# Altium schematic sheet Giro_scope_2.0.SchDoc
size A1; SheetNumber: 1; SheetTotal: 1
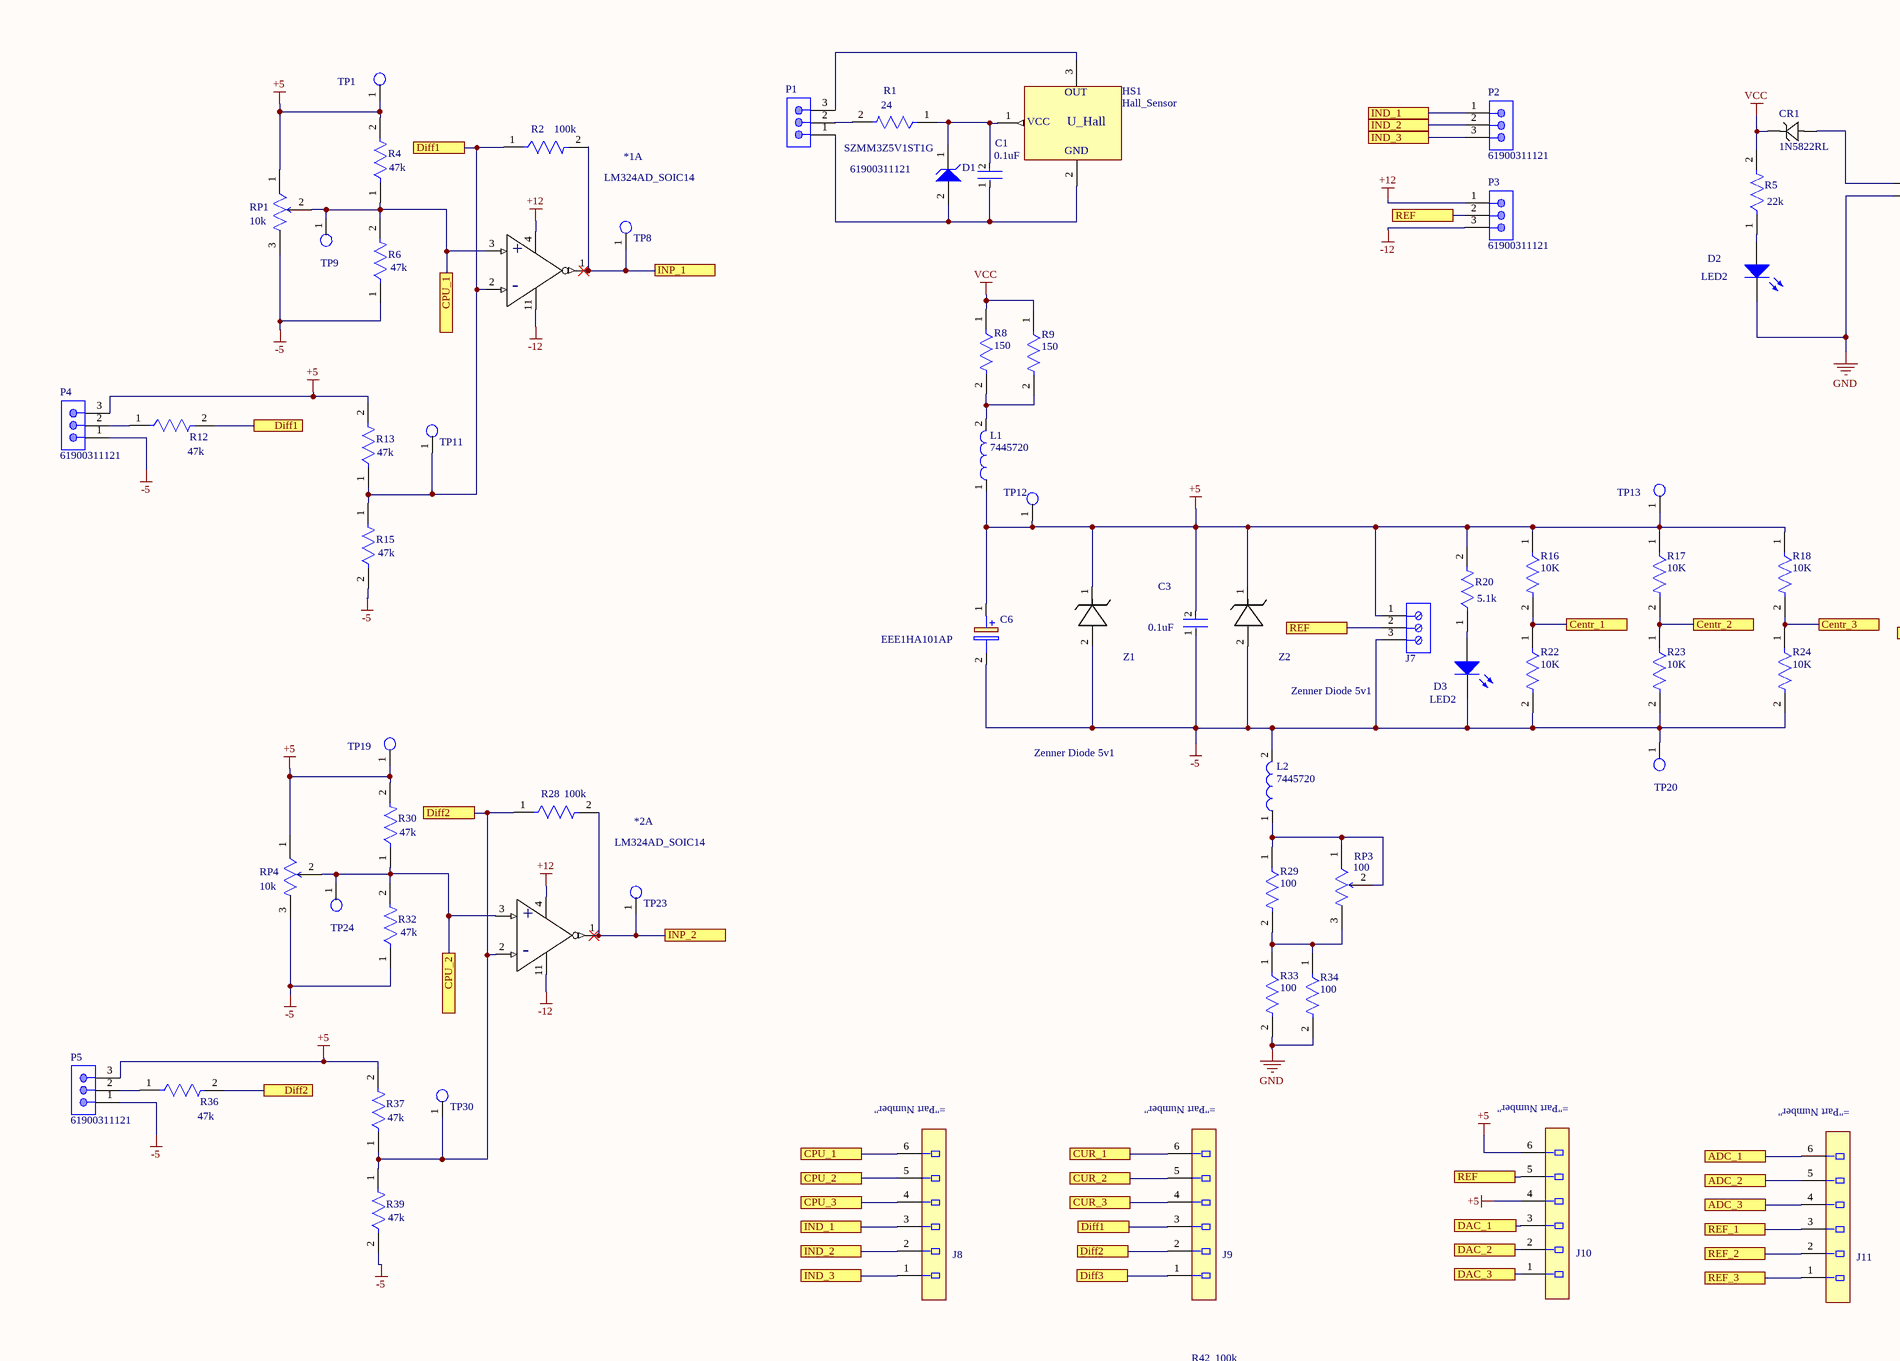
[diagram p0: Giro_scope_2.0.SchDoc, top left]
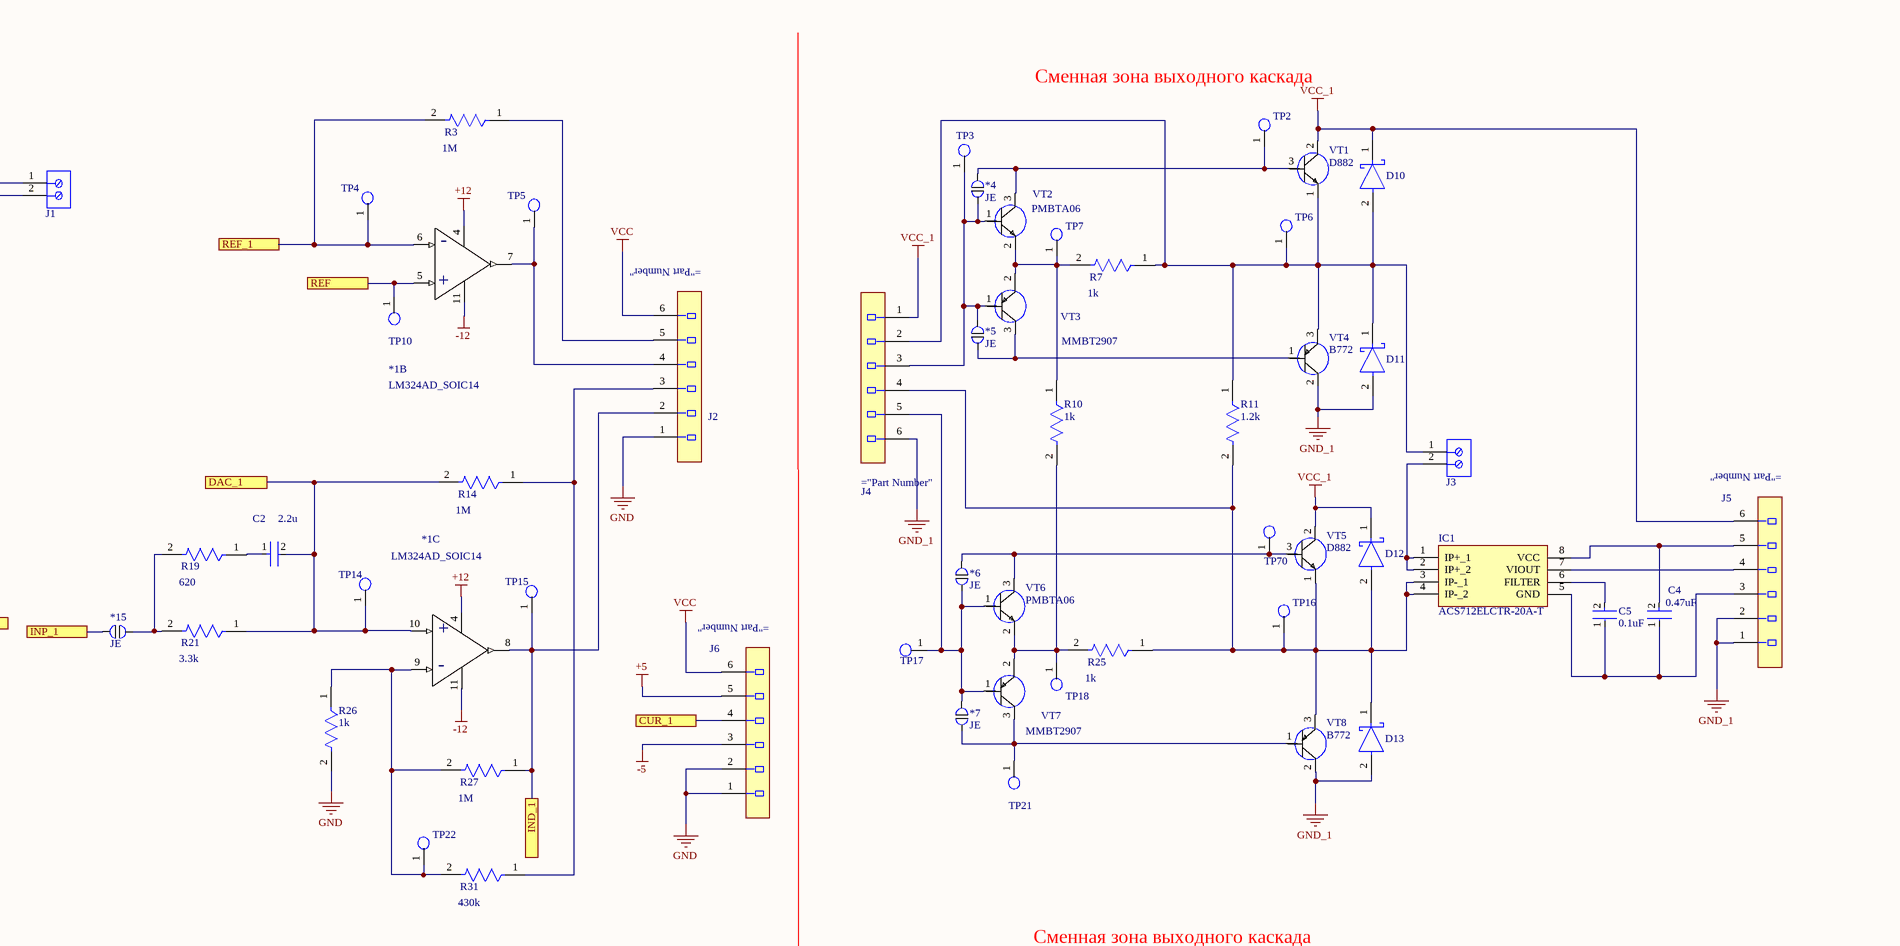
[diagram p1: Giro_scope_2.0.SchDoc, top right]
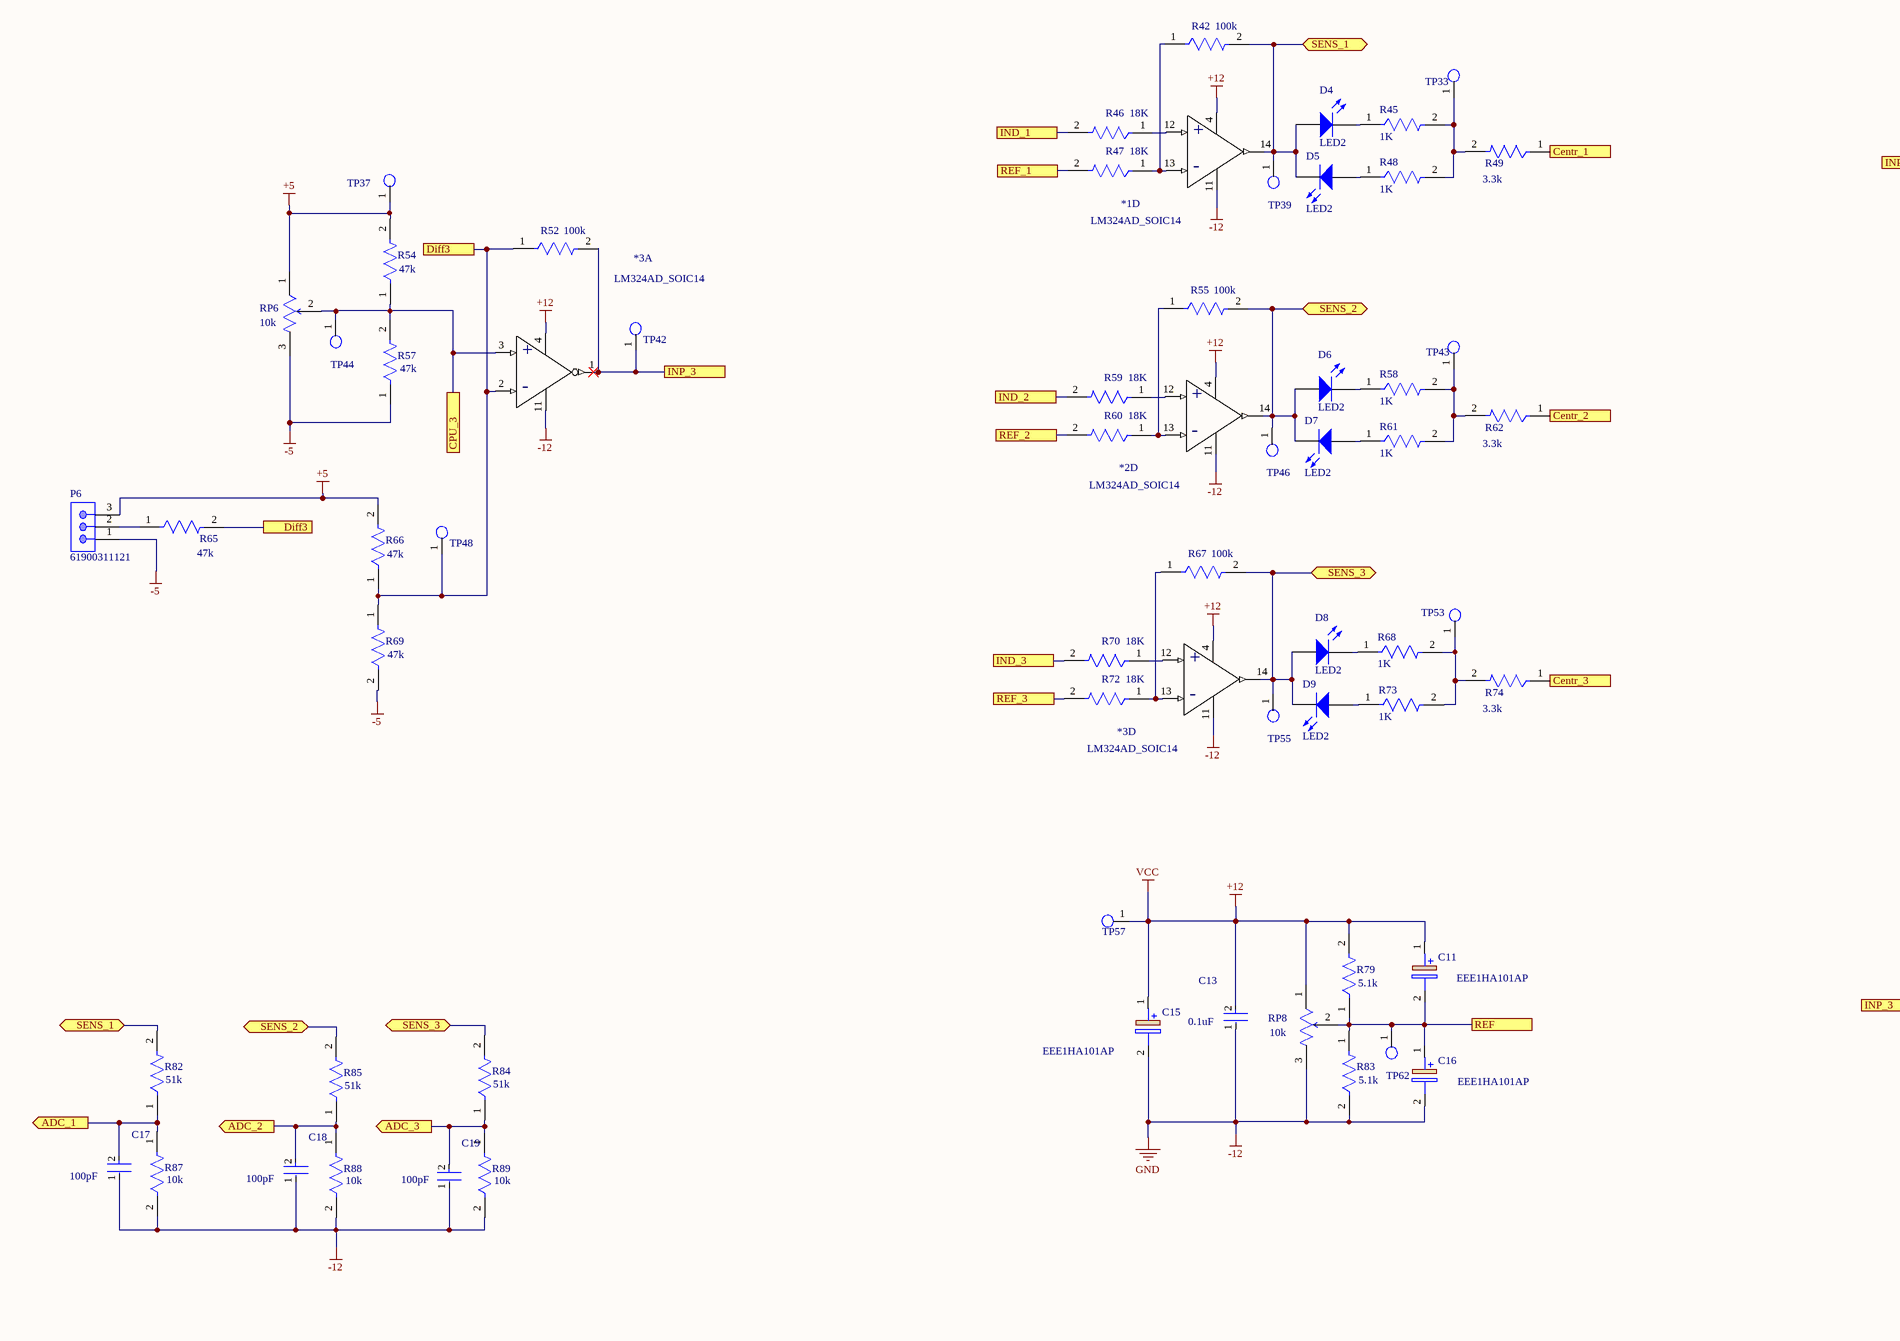
[diagram p2: Giro_scope_2.0.SchDoc, bottom left]
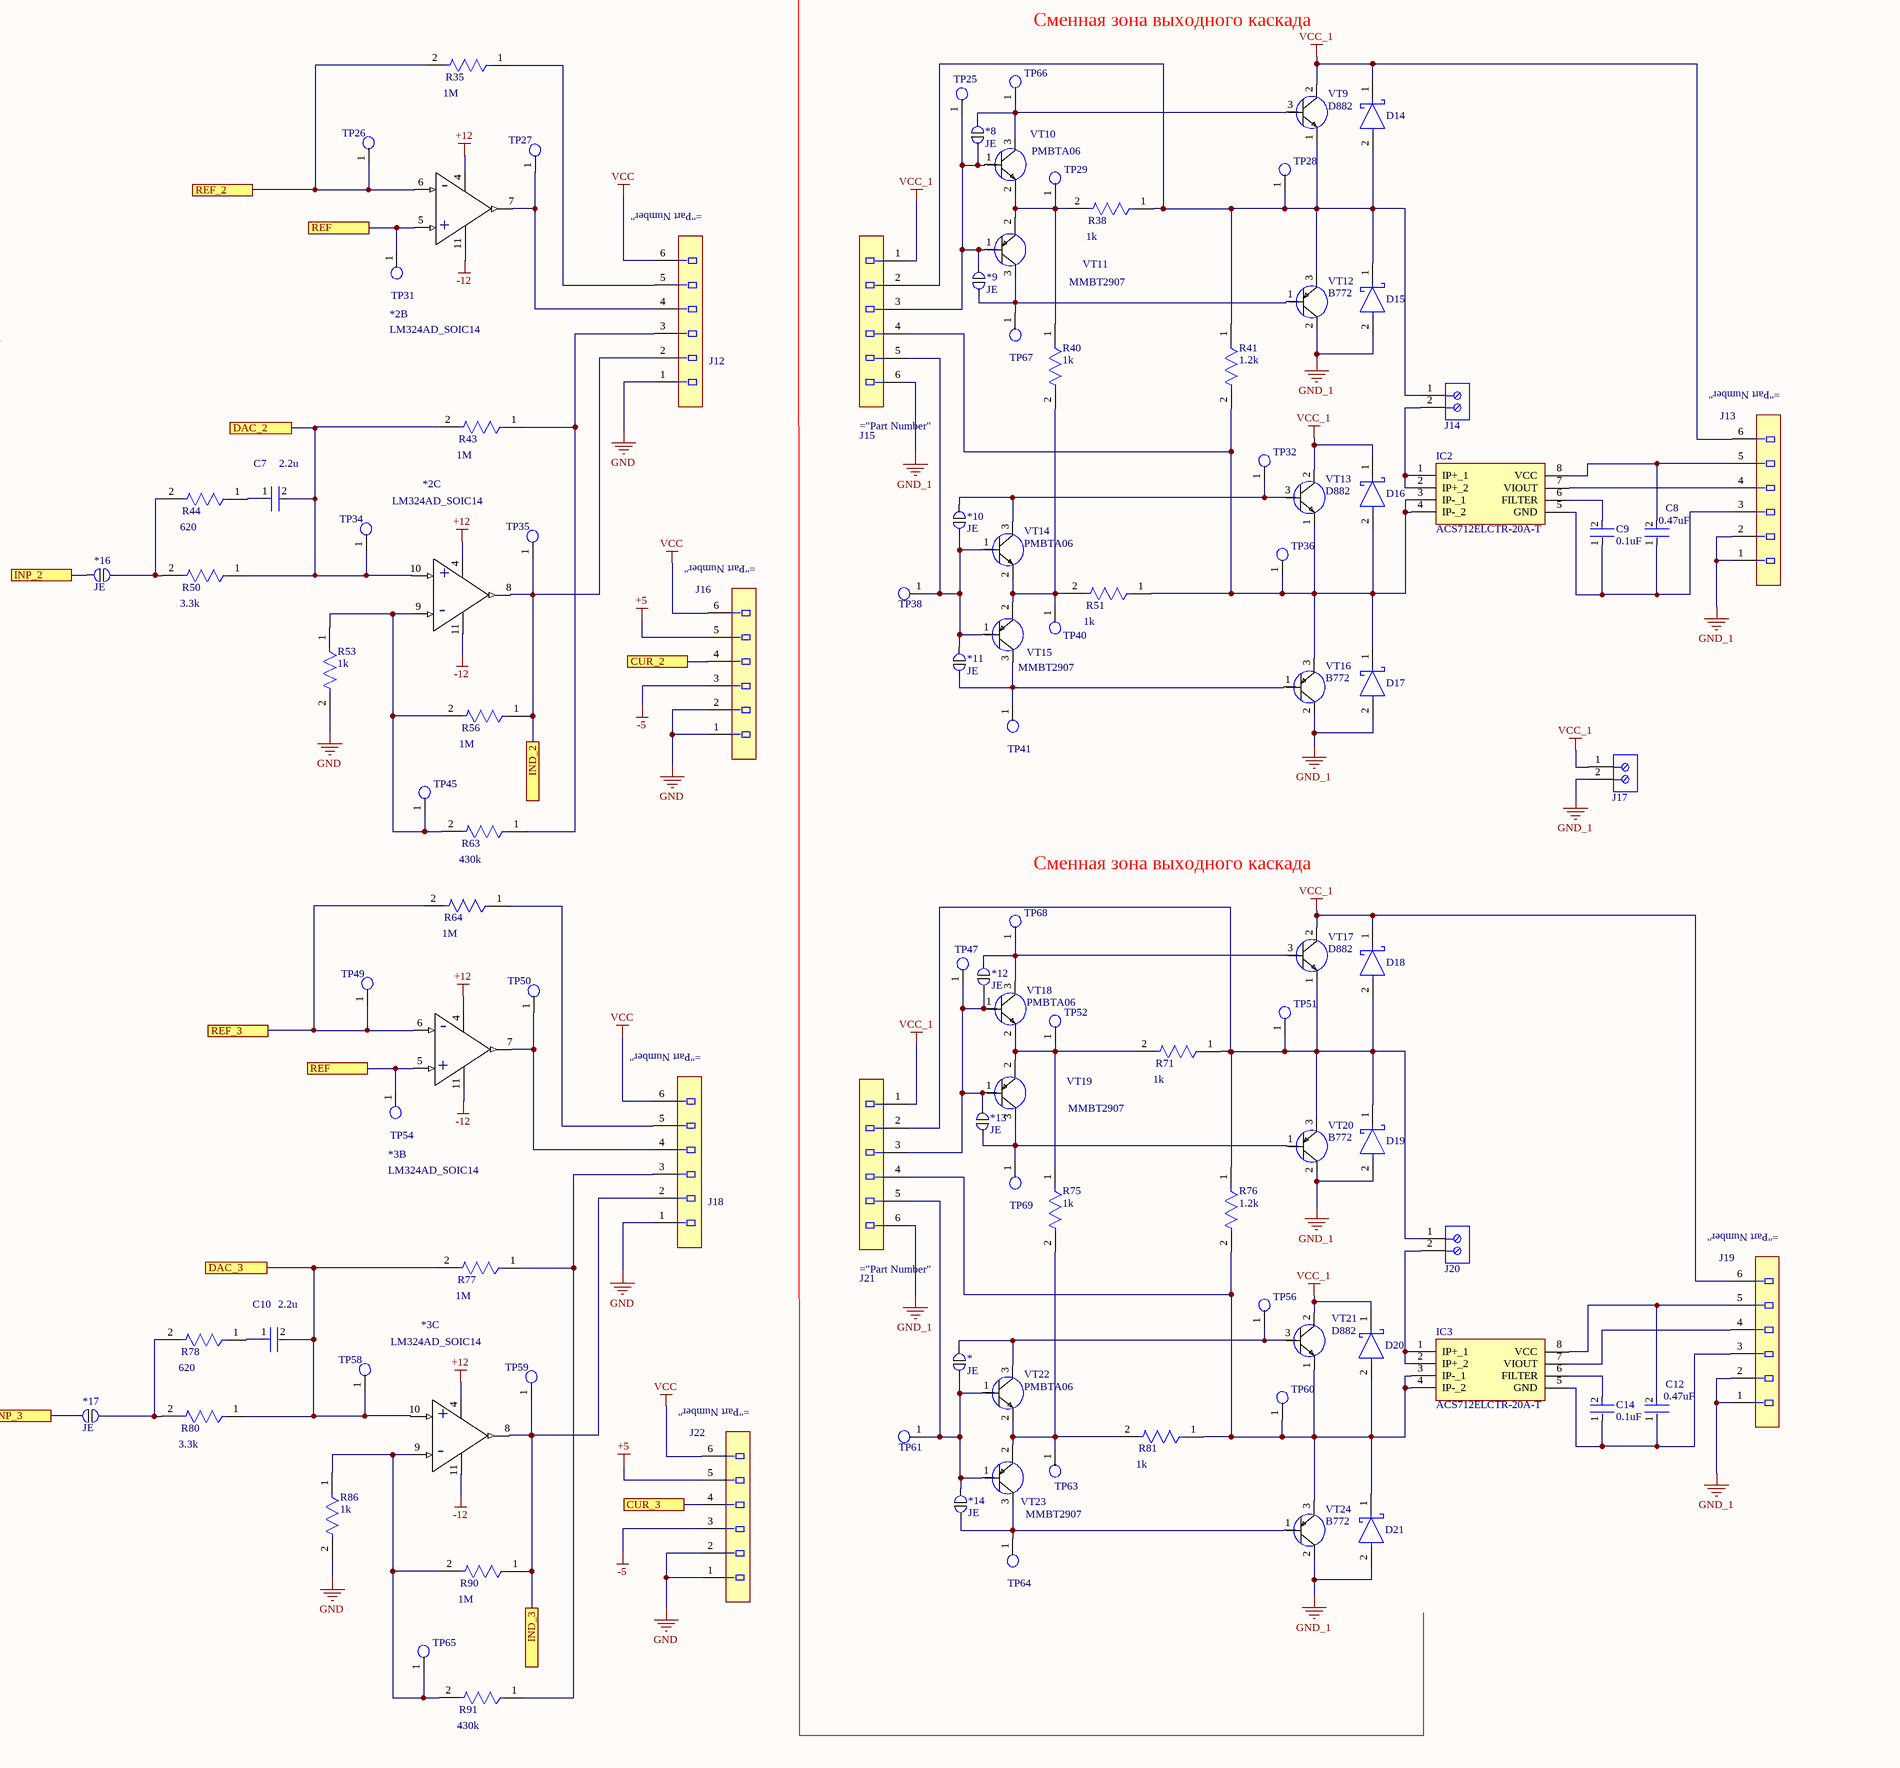
[diagram p3: Giro_scope_2.0.SchDoc, bottom right]

## Parts
*  JE  [JE]
*1  LM324AD_SOIC14  [D14-M]  (parts A,B,C,D of 4)
*2  LM324AD_SOIC14  [D14-M]  (parts A,B,C,D of 4)
*3  LM324AD_SOIC14  [D14-M]  (parts A,B,C,D of 4)
*4  JE  [JE]
*5  JE  [JE]
*6  JE  [JE]
*7  JE  [JE]
*8  JE  [JE]
*9  JE  [JE]
*10  JE  [JE]
*11  JE  [JE]
*12  JE  [JE]
*13  JE  [JE]
*14  JE  [JE]
*15  JE  [JE]
*16  JE  [JE]
*17  JE  [JE]
C1  0.1uF  [KEMET_C0805C-DN_IPC_C]
C2  2.2u  [KEMET_C0805C-DN_IPC_A]
C3  0.1uF  [KEMET_C0805C-DN_IPC_C]
C4  0.47uF  [KEMET_C0805C-DN_IPC_C]
C5  0.1uF  [KEMET_C0805C-DN_IPC_C]
C6  EEE1HA101AP  [EEEFK1V331P]
C7  2.2u  [KEMET_C0805C-DN_IPC_A]
C8  0.47uF  [KEMET_C0805C-DN_IPC_C]
C9  0.1uF  [KEMET_C0805C-DN_IPC_C]
C10  2.2u  [KEMET_C0805C-DN_IPC_A]
C11  EEE1HA101AP  [EEEFK1V331P]
C12  0.47uF  [KEMET_C0805C-DN_IPC_C]
C13  0.1uF  [KEMET_C0805C-DN_IPC_C]
C14  0.1uF  [KEMET_C0805C-DN_IPC_C]
C15  EEE1HA101AP  [EEEFK1V331P]
C16  EEE1HA101AP  [EEEFK1V331P]
C17  100pF  [KEMET_C0805C-DN_IPC_A]
C18  100pF  [KEMET_C0805C-DN_IPC_A]
C19  100pF  [KEMET_C0805C-DN_IPC_A]
CR1  1N5822RL  [DO-201AD_STM]
D1  SZMM3Z5V1ST1G  [ONSC-SOD-323-2-477-02_V]
D2  LED2  [Wurth_Electronics_0_MFG]
D3  LED2  [Wurth_Electronics_0_MFG]
D4  LED2  [LED_BLUE]
D5  LED2  [Wurth_Electronics_0_MFG]
D6  LED2  [LED_BLUE]
D7  LED2  [Wurth_Electronics_0_MFG]
D8  LED2  [LED_BLUE]
D9  LED2  [Wurth_Electronics_0_MFG]
D10  Diode_Vishay_SS16-E3-61T_eec  [Vishay_SS16-E3-61T_0]  (value not drawn)
D11  Diode_Vishay_SS16-E3-61T_eec  [Vishay_SS16-E3-61T_0]  (value not drawn)
D12  Diode_Vishay_SS16-E3-61T_eec  [Vishay_SS16-E3-61T_0]  (value not drawn)
D13  Diode_Vishay_SS16-E3-61T_eec  [Vishay_SS16-E3-61T_0]  (value not drawn)
D14  Diode_Vishay_SS16-E3-61T_eec  [Vishay_SS16-E3-61T_0]  (value not drawn)
D15  Diode_Vishay_SS16-E3-61T_eec  [Vishay_SS16-E3-61T_0]  (value not drawn)
D16  Diode_Vishay_SS16-E3-61T_eec  [Vishay_SS16-E3-61T_0]  (value not drawn)
D17  Diode_Vishay_SS16-E3-61T_eec  [Vishay_SS16-E3-61T_0]  (value not drawn)
D18  Diode_Vishay_SS16-E3-61T_eec  [Vishay_SS16-E3-61T_0]  (value not drawn)
D19  Diode_Vishay_SS16-E3-61T_eec  [Vishay_SS16-E3-61T_0]  (value not drawn)
D20  Diode_Vishay_SS16-E3-61T_eec  [Vishay_SS16-E3-61T_0]  (value not drawn)
D21  Diode_Vishay_SS16-E3-61T_eec  [Vishay_SS16-E3-61T_0]  (value not drawn)
HS1  Hall_Sensor  [SS495E_Hall_Sensor]
IC1  ACS712ELCTR-20A-T  [ACS712]
IC2  ACS712ELCTR-20A-T  [ACS712]
IC3  ACS712ELCTR-20A-T  [ACS712]
J1  691103110003  [691101710002]  (value not drawn)
J2  61300611121  [Wurth_61300611121_0]  (value not drawn)
J3  691101710002  [691101710002]  (value not drawn)
J4  61300611121  [2.54_Connector _x6]  (value not drawn)
J5  61300611121  [2.54_Connector _x6]  (value not drawn)
J6  61300611121  [Wurth_61300611121_0]  (value not drawn)
J7  691101710003  [691101710003]  (value not drawn)
J8  61300611121  [Wurth_61300611121_0]  (value not drawn)
J9  61300611121  [Wurth_61300611121_0]  (value not drawn)
J10  61300611121  [Wurth_61300611121_0]  (value not drawn)
J11  61300611121  [Wurth_61300611121_0]  (value not drawn)
J12  61300611121  [Wurth_61300611121_0]  (value not drawn)
J13  61300611121  [2.54_Connector _x6]  (value not drawn)
J14  691101710002  [691101710002]  (value not drawn)
J15  61300611121  [2.54_Connector _x6]  (value not drawn)
J16  61300611121  [Wurth_61300611121_0]  (value not drawn)
J17  691101710002  [691101710002]  (value not drawn)
J18  61300611121  [Wurth_61300611121_0]  (value not drawn)
J19  61300611121  [2.54_Connector _x6]  (value not drawn)
J20  691101710002  [691101710002]  (value not drawn)
J21  61300611121  [2.54_Connector _x6]  (value not drawn)
J22  61300611121  [Wurth_61300611121_0]  (value not drawn)
L1  7445720  [WE-PD4-XL]
L2  7445720  [WE-PD4-XL]
P1  61900311121  [61900311121]
P2  61900311121  [61900311121]
P3  61900311121  [61900311121]
P4  61900311121  [61900311121]
P5  61900311121  [61900311121]
P6  61900311121  [61900311121]
R1  24  [Vishay_CRCW0805-e3_IPC_B]
R2  100k  [Vishay_CRCW0805-e3_IPC_A]
R3  1M  [Vishay_CRCW0805-e3_IPC_A]
R4  47k  [Vishay_CRCW0805-e3_IPC_A]
R5  22k  [Vishay_CRCW0805-e3_MFG]
R6  47k  [Vishay_CRCW0805-e3_IPC_A]
R7  1k  [Vishay_CRCW0805-e3_IPC_A]
R8  150  [RC1210N_PAN]
R9  150  [RC1210N_PAN]
R10  1k  [Vishay_CRCW0805-e3_IPC_A]
R11  1.2k  [Vishay_CRCW0805-e3_IPC_A]
R12  47k  [Vishay_CRCW0805-e3_IPC_A]
R13  47k  [Vishay_CRCW0805-e3_IPC_A]
R14  1M  [Vishay_CRCW0805-e3_IPC_A]
R15  47k  [Vishay_CRCW0805-e3_IPC_A]
R16  10K  [Vishay_CRCW0805-e3_IPC_A]
R17  10K  [Vishay_CRCW0805-e3_IPC_A]
R18  10K  [Vishay_CRCW0805-e3_IPC_A]
R19  620  [Vishay_CRCW0805-e3_IPC_A]
R20  5.1k  [Vishay_CRCW0805-e3_MFG]
R21  3.3k  [Vishay_CRCW0805-e3_IPC_A]
R22  10K  [Vishay_CRCW0805-e3_MFG]
R23  10K  [Vishay_CRCW0805-e3_IPC_A]
R24  10K  [Vishay_CRCW0805-e3_IPC_A]
R25  1k  [Vishay_CRCW0805-e3_IPC_A]
R26  1k  [Vishay_CRCW0805-e3_IPC_A]
R27  1M  [Vishay_CRCW0805-e3_IPC_A]
R28  100k  [Vishay_CRCW0805-e3_IPC_A]
R29  100  [RC1210N_PAN]
R30  47k  [Vishay_CRCW0805-e3_IPC_A]
R31  430k  [Vishay_CRCW0805-e3_IPC_A]
R32  47k  [Vishay_CRCW0805-e3_IPC_A]
R33  100  [RC1210N_PAN]
R34  100  [RC1210N_PAN]
R35  1M  [Vishay_CRCW0805-e3_IPC_A]
R36  47k  [Vishay_CRCW0805-e3_IPC_A]
R37  47k  [Vishay_CRCW0805-e3_IPC_A]
R38  1k  [Vishay_CRCW0805-e3_IPC_A]
R39  47k  [Vishay_CRCW0805-e3_IPC_A]
R40  1k  [Vishay_CRCW0805-e3_IPC_A]
R41  1.2k  [Vishay_CRCW0805-e3_IPC_A]
R42  100k  [Vishay_CRCW0805-e3_IPC_A]
R43  1M  [Vishay_CRCW0805-e3_IPC_A]
R44  620  [Vishay_CRCW0805-e3_IPC_A]
R45  1K  [Vishay_CRCW0805-e3_IPC_A]
R46  18K  [Vishay_CRCW0805-e3_IPC_A]
R47  18K  [Vishay_CRCW0805-e3_IPC_A]
R48  1K  [Vishay_CRCW0805-e3_IPC_A]
R49  3.3k  [Vishay_CRCW0805-e3_IPC_A]
R50  3.3k  [Vishay_CRCW0805-e3_IPC_A]
R51  1k  [Vishay_CRCW0805-e3_IPC_A]
R52  100k  [Vishay_CRCW0805-e3_IPC_A]
R53  1k  [Vishay_CRCW0805-e3_IPC_A]
R54  47k  [Vishay_CRCW0805-e3_IPC_A]
R55  100k  [Vishay_CRCW0805-e3_IPC_A]
R56  1M  [Vishay_CRCW0805-e3_IPC_A]
R57  47k  [Vishay_CRCW0805-e3_IPC_A]
R58  1K  [Vishay_CRCW0805-e3_IPC_A]
R59  18K  [Vishay_CRCW0805-e3_IPC_A]
R60  18K  [Vishay_CRCW0805-e3_IPC_A]
R61  1K  [Vishay_CRCW0805-e3_IPC_A]
R62  3.3k  [Vishay_CRCW0805-e3_IPC_A]
R63  430k  [Vishay_CRCW0805-e3_IPC_A]
R64  1M  [Vishay_CRCW0805-e3_IPC_A]
R65  47k  [Vishay_CRCW0805-e3_IPC_A]
R66  47k  [Vishay_CRCW0805-e3_IPC_A]
R67  100k  [Vishay_CRCW0805-e3_IPC_A]
R68  1K  [Vishay_CRCW0805-e3_IPC_A]
R69  47k  [Vishay_CRCW0805-e3_IPC_A]
R70  18K  [Vishay_CRCW0805-e3_IPC_A]
R71  1k  [Vishay_CRCW0805-e3_IPC_A]
R72  18K  [Vishay_CRCW0805-e3_IPC_A]
R73  1K  [Vishay_CRCW0805-e3_IPC_A]
R74  3.3k  [Vishay_CRCW0805-e3_IPC_A]
R75  1k  [Vishay_CRCW0805-e3_IPC_A]
R76  1.2k  [Vishay_CRCW0805-e3_IPC_A]
R77  1M  [Vishay_CRCW0805-e3_IPC_A]
R78  620  [Vishay_CRCW0805-e3_IPC_A]
R79  5.1k  [Vishay_CRCW0805-e3_IPC_A]
R80  3.3k  [Vishay_CRCW0805-e3_IPC_A]
R81  1k  [Vishay_CRCW0805-e3_IPC_A]
R82  51k  [Vishay_CRCW0805-e3_IPC_A]
R83  5.1k  [Vishay_CRCW0805-e3_IPC_A]
R84  51k  [Vishay_CRCW0805-e3_IPC_A]
R85  51k  [Vishay_CRCW0805-e3_IPC_A]
R86  1k  [Vishay_CRCW0805-e3_IPC_A]
R87  10k  [Vishay_CRCW0805-e3_IPC_A]
R88  10k  [Vishay_CRCW0805-e3_IPC_A]
R89  10k  [Vishay_CRCW0805-e3_IPC_A]
R90  1M  [Vishay_CRCW0805-e3_IPC_A]
R91  430k  [Vishay_CRCW0805-e3_IPC_A]
RP1  10k  [Bourns_3296W_MFG]
RP3  100  [Bourns_3296W_MFG]
RP4  10k  [Bourns_3296W_MFG]
RP6  10k  [Bourns_3296W_MFG]
RP8  10k  [Bourns_3296W_MFG]
TP1  Test_Point_PCB  [Test_Point]  (value not drawn)
TP2  Test_Point_PCB  [Test_Point]  (value not drawn)
TP3  Test_Point_PCB  [Test_Point]  (value not drawn)
TP4  Test_Point_PCB  [Test_Point]  (value not drawn)
TP5  Test_Point_PCB  [Test_Point]  (value not drawn)
TP6  Test_Point_PCB  [Test_Point]  (value not drawn)
TP7  Test_Point_PCB  [Test_Point]  (value not drawn)
TP8  Test_Point_PCB  [Test_Point]  (value not drawn)
TP9  Test_Point_PCB  [Test_Point]  (value not drawn)
TP10  Test_Point_PCB  [Test_Point]  (value not drawn)
TP11  Test_Point_PCB  [Test_Point]  (value not drawn)
TP12  Test_Point_PCB  [Test_Point]  (value not drawn)
TP13  Test_Point_PCB  [Test_Point]  (value not drawn)
TP14  Test_Point_PCB  [Test_Point]  (value not drawn)
TP15  Test_Point_PCB  [Test_Point]  (value not drawn)
TP16  Test_Point_PCB  [Test_Point]  (value not drawn)
TP17  Test_Point_PCB  [Test_Point]  (value not drawn)
TP18  Test_Point_PCB  [Test_Point]  (value not drawn)
TP19  Test_Point_PCB  [Test_Point]  (value not drawn)
TP20  Test_Point_PCB  [Test_Point]  (value not drawn)
TP21  Test_Point_PCB  [Test_Point]  (value not drawn)
TP22  Test_Point_PCB  [Test_Point]  (value not drawn)
TP23  Test_Point_PCB  [Test_Point]  (value not drawn)
TP24  Test_Point_PCB  [Test_Point]  (value not drawn)
TP25  Test_Point_PCB  [Test_Point]  (value not drawn)
TP26  Test_Point_PCB  [Test_Point]  (value not drawn)
TP27  Test_Point_PCB  [Test_Point]  (value not drawn)
TP28  Test_Point_PCB  [Test_Point]  (value not drawn)
TP29  Test_Point_PCB  [Test_Point]  (value not drawn)
TP30  Test_Point_PCB  [Test_Point]  (value not drawn)
TP31  Test_Point_PCB  [Test_Point]  (value not drawn)
TP32  Test_Point_PCB  [Test_Point]  (value not drawn)
TP33  Test_Point_PCB  [Test_Point]  (value not drawn)
TP34  Test_Point_PCB  [Test_Point]  (value not drawn)
TP35  Test_Point_PCB  [Test_Point]  (value not drawn)
TP36  Test_Point_PCB  [Test_Point]  (value not drawn)
TP37  Test_Point_PCB  [Test_Point]  (value not drawn)
TP38  Test_Point_PCB  [Test_Point]  (value not drawn)
TP39  Test_Point_PCB  [Test_Point]  (value not drawn)
TP40  Test_Point_PCB  [Test_Point]  (value not drawn)
TP41  Test_Point_PCB  [Test_Point]  (value not drawn)
TP42  Test_Point_PCB  [Test_Point]  (value not drawn)
TP43  Test_Point_PCB  [Test_Point]  (value not drawn)
TP44  Test_Point_PCB  [Test_Point]  (value not drawn)
TP45  Test_Point_PCB  [Test_Point]  (value not drawn)
TP46  Test_Point_PCB  [Test_Point]  (value not drawn)
TP47  Test_Point_PCB  [Test_Point]  (value not drawn)
TP48  Test_Point_PCB  [Test_Point]  (value not drawn)
TP49  Test_Point_PCB  [Test_Point]  (value not drawn)
TP50  Test_Point_PCB  [Test_Point]  (value not drawn)
TP51  Test_Point_PCB  [Test_Point]  (value not drawn)
TP52  Test_Point_PCB  [Test_Point]  (value not drawn)
TP53  Test_Point_PCB  [Test_Point]  (value not drawn)
TP54  Test_Point_PCB  [Test_Point]  (value not drawn)
TP55  Test_Point_PCB  [Test_Point]  (value not drawn)
TP56  Test_Point_PCB  [Test_Point]  (value not drawn)
TP57  Test_Point_PCB  [Test_Point]  (value not drawn)
TP58  Test_Point_PCB  [Test_Point]  (value not drawn)
TP59  Test_Point_PCB  [Test_Point]  (value not drawn)
TP60  Test_Point_PCB  [Test_Point]  (value not drawn)
TP61  Test_Point_PCB  [Test_Point]  (value not drawn)
TP62  Test_Point_PCB  [Test_Point]  (value not drawn)
TP63  Test_Point_PCB  [Test_Point]  (value not drawn)
TP64  Test_Point_PCB  [Test_Point]  (value not drawn)
TP65  Test_Point_PCB  [Test_Point]  (value not drawn)
TP66  Test_Point_PCB  [Test_Point]  (value not drawn)
TP67  Test_Point_PCB  [Test_Point]  (value not drawn)
TP68  Test_Point_PCB  [Test_Point]  (value not drawn)
TP69  Test_Point_PCB  [Test_Point]  (value not drawn)
TP70  Test_Point_PCB  [Test_Point]  (value not drawn)
VT1  D882  [D882]
VT2  PMBTA06  [SOT-23_ONS-M]
VT3  MMBT2907  [SOT-23_ONS]
VT4  B772  [PCBComponent_1]
VT5  D882  [D882]
VT6  PMBTA06  [SOT-23_ONS-M]
VT7  MMBT2907  [SOT-23_ONS]
VT8  B772  [PCBComponent_1]
VT9  D882  [D882]
VT10  PMBTA06  [SOT-23_ONS-M]
VT11  MMBT2907  [SOT-23_ONS]
VT12  B772  [PCBComponent_1]
VT13  D882  [D882]
VT14  PMBTA06  [SOT-23_ONS-M]
VT15  MMBT2907  [SOT-23_ONS]
VT16  B772  [PCBComponent_1]
VT17  D882  [D882]
VT18  PMBTA06  [SOT-23_ONS-M]
VT19  MMBT2907  [SOT-23_ONS]
VT20  B772  [PCBComponent_1]
VT21  D882  [D882]
VT22  PMBTA06  [SOT-23_ONS-M]
VT23  MMBT2907  [SOT-23_ONS]
VT24  B772  [PCBComponent_1]
Z1  Zenner Diode 5v1  [BZX85C5V1(YJ)]
Z2  Zenner Diode 5v1  [BZX85C5V1(YJ)]

## Ports
ADC_1, ADC_1 (out), ADC_2, ADC_2 (out), ADC_3, ADC_3 (out), Centr_1, Centr_2, Centr_3, CPU_1, CPU_2, CPU_3, CUR_1, CUR_2, CUR_3, DAC_1, DAC_2, DAC_3, Diff1, Diff2, Diff3, IND_1, IND_2, IND_3, INP_1, INP_2, INP_3, REF, REF_1, REF_2, REF_3, SENS_1 (bidir), SENS_2 (bidir), SENS_3 (bidir)

## Nets
+5: C3.2 C6.1(+) J6.5 J7.1 J10.4 J10.6 J16.5 J22.5 L1.1 P4.3 P5.3 P6.3 R4.2 R13.2 R16.1 R17.1 R18.1 R20.2 R30.2 R37.2 R54.2 R66.2 RP1.1(CCW) RP4.1(CCW) RP6.1(CCW) TP1.1(G9) TP12.1(G9) TP13.1(G9) TP19.1(G9) TP37.1(G9) Z1.1(Cathod) Z2.1(Cathod)
+12: *1.4(+VCC) *2.4(+VCC) *3.4(+VCC) C11.1(+) C13.2 C15.1(+) CR1.1 J2.6 J6.6 J12.6 J16.6 J18.6 J22.6 P3.1 R5.2 R8.1 R9.1 R79.2 RP8.1(CCW) TP57.1(G9)  [also labelled VCC]
-5: C3.1 C6.2(-) D3.2(K) J6.3 J7.3 J16.3 J22.3 L2.2 P4.1 P5.1 P6.1 R6.1 R15.2 R22.2 R23.2 R24.2 R32.1 R39.2 R57.1 R69.2 RP1.3(CW) RP4.3(CW) RP6.3(CW) TP20.1(G9) Z1.2(Anode) Z2.2(Anode)
-12: *1.11(GND) *2.11(GND) *3.11(GND) C13.1 C15.2(-) C16.2(-) C17.1 C18.1 C19.1 D2.2(K) J1.2 J2.1 J6.1 J6.2 J12.1 J16.1 J16.2 J18.1 J22.1 J22.2 P3.3 R26.2 R33.2 R34.2 R53.2 R83.2 R86.2 R87.2 R88.2 R89.2 RP8.3(CW)  [also labelled GND]
GND_1: D11.2(A) D13.2(A) D15.2(A) D17.2(A) D19.2(A) D21.2(A) J4.6 J5.1 J5.2 J13.1 J13.2 J15.6 J17.2 J19.1 J19.2 J21.6 VT4.2(C) VT8.2(C) VT12.2(C) VT16.2(C) VT20.2(C) VT24.2(C)
VCC_1: D10.1(C) D12.1(C) D14.1(C) D16.1(C) D18.1(C) D20.1(C) J4.1 J5.6 J13.6 J15.1 J17.1 J19.6 J21.1 VT1.2(C) VT5.2(C) VT9.2(C) VT13.2(C) VT17.2(C) VT21.2(C)
ADC_1: C17.2 J11.6 R82.1 R87.1 ; port ADC_1
ADC_2: C18.2 J11.5 R85.1 R88.1 ; port ADC_2
ADC_3: C19.2 J11.4 R84.1 R89.1 ; port ADC_3
Centr_1: R16.2 R22.1 R49.1 ; port Centr_1
Centr_2: R17.2 R23.1 R62.1 ; port Centr_2
Centr_3: R18.2 R24.1 R74.1 ; port Centr_3
CPU_1: *1.3(+INP_1) J8.6 R4.1 R6.2 RP1.2(WIPER) TP9.1(G9) ; port CPU_1
CPU_2: *2.3(+INP_1) J8.5 R30.1 R32.2 RP4.2(WIPER) TP24.1(G9) ; port CPU_2
CPU_3: *3.3(+INP_1) J8.4 R54.1 R57.2 RP6.2(WIPER) TP44.1(G9) ; port CPU_3
CUR_1: J6.4 J9.6 ; port CUR_1
CUR_2: J9.5 J16.4 ; port CUR_2
CUR_3: J9.4 J22.4 ; port CUR_3
DAC_1: *1.10(+INP_3) C2.2 J10.3 R14.2 R21.1 TP14.1(G9) ; port DAC_1
DAC_2: *2.10(+INP_3) C7.2 J10.2 R43.2 R50.1 TP34.1(G9) ; port DAC_2
DAC_3: *3.10(+INP_3) C10.2 J10.1 R77.2 R80.1 TP58.1(G9) ; port DAC_3
Diff1: *1.2(-INP_1) J9.3 R2.1 R12.2 R13.1 R15.1 TP11.1(G9) ; port Diff1
Diff2: *2.2(-INP_1) J9.2 R28.1 R36.2 R37.1 R39.1 TP30.1(G9) ; port Diff2
Diff3: *3.2(-INP_1) J9.1 R52.1 R65.2 R66.1 R69.1 TP48.1(G9) ; port Diff3
IND_1: *1.8(OUT_3) J2.2 J8.3 P2.1 R27.1 R46.2 TP15.1(G9) ; port IND_1
IND_2: *2.8(OUT_3) J8.2 J12.2 P2.2 R56.1 R59.2 TP35.1(G9) ; port IND_2
IND_3: *3.8(OUT_3) J8.1 J18.2 P2.3 R70.2 R90.1 TP59.1(G9) ; port IND_3
INP_1: *1.1(OUT_1) *15.2 R2.2 TP8.1(G9) ; port INP_1
INP_2: *2.1(OUT_1) *16.2 R28.2 TP23.1(G9) ; port INP_2
INP_3: *3.1(OUT_1) *17.2 R52.2 TP42.1(G9) ; port INP_3
REF: *1.5(+INP_2) *2.5(+INP_2) *3.5(+INP_2) C11.2(-) C16.1(+) J7.2 J10.5 P3.2 R79.1 R83.1 RP8.2(WIPER) TP10.1(G9) TP31.1(G9) TP54.1(G9) TP62.1(G9) ; port REF
REF_1: *1.6(-INP_2) J11.3 R3.2 R47.2 TP4.1(G9) ; port REF_1
REF_2: *2.6(-INP_2) J11.2 R35.2 R60.2 TP26.1(G9) ; port REF_2
REF_3: *3.6(-INP_2) J11.1 R64.2 R72.2 TP49.1(G9) ; port REF_3
SENS_1: *1.14(OUT_4) D4.1(A) D5.2(K) R42.2 R82.2 TP39.1(G9) ; port SENS_1
SENS_2: *2.14(OUT_4) D6.1(A) D7.2(K) R55.2 R85.2 TP46.1(G9) ; port SENS_2
SENS_3: *3.14(OUT_4) D8.1(A) D9.2(K) R67.2 R84.2 TP55.1(G9) ; port SENS_3
Net*1_7: *1.7(OUT_2) J2.4 TP5.1(G9)
Net*1_9: *1.9(-INP_3) R26.1 R27.2 R31.2 TP22.1(G9)
Net*1_12: *1.12(+INP_4) R46.1
Net*1_13: *1.13(-INP_4) R42.1 R47.1
Net*2_7: *2.7(OUT_2) J12.4 TP27.1(G9)
Net*2_9: *2.9(-INP_3) R53.1 R56.2 R63.2 TP45.1(G9)
Net*2_12: *2.12(+INP_4) R59.1
Net*2_13: *2.13(-INP_4) R55.1 R60.1
Net*3_7: *3.7(OUT_2) J18.4 TP50.1(G9)
Net*3_9: *3.9(-INP_3) R86.1 R90.2 R91.2 TP65.1(G9)
Net*3_12: *3.12(+INP_4) R70.1
Net*3_13: *3.13(-INP_4) R67.1 R72.1
Net*4_1: *4.1 *5.2 J4.3 TP3.1(G9) VT2.1(B) VT3.1(B)
Net*4_2: *4.2 TP2.1(G9) VT1.3(B) VT2.3(C)
Net*5_1: *5.1 VT3.3(C) VT4.1(B)
Net*6_1: *6.1 *7.2 J4.5 TP17.1(G9) VT6.1(B) VT7.1(B)
Net*6_2: *6.2 TP70.1(G9) VT5.3(B) VT6.3(C)
Net*7_1: *7.1 TP21.1(G9) VT7.3(C) VT8.1(B)
Net*8_1: *8.1 *9.1 J15.3 TP25.1(G9) VT10.1(B) VT11.1(B)
Net*8_2: *8.2 TP66.1(G9) VT9.3(B) VT10.3(C)
Net*9_2: *9.2 TP67.1(G9) VT11.3(C) VT12.1(B)
Net*10_1: *10.1 *11.2 J15.5 TP38.1(G9) VT14.1(B) VT15.1(B)
Net*10_2: *10.2 TP32.1(G9) VT13.3(B) VT14.3(C)
Net*11_1: *11.1 TP41.1(G9) VT15.3(C) VT16.1(B)
Net*12_1: *12.1 *13.2 J21.3 TP47.1(G9) VT18.1(B) VT19.1(B)
Net*12_2: *12.2 TP68.1(G9) VT17.3(B) VT18.3(C)
Net*13_1: *13.1 TP69.1(G9) VT19.3(C) VT20.1(B)
Net*14_1: *14.1 TP64.1(G9) VT23.3(C) VT24.1(B)
Net*15_1: *15.1 R19.2 R21.2
Net*16_1: *16.1 R44.2 R50.2
Net*17_1: *17.1 R78.2 R80.2
Net*_1: *.1 *14.2 J21.5 TP61.1(G9) VT22.1(B) VT23.1(B)
Net*_2: *.2 TP56.1(G9) VT21.3(B) VT22.3(C)
NetC1_1: C1.1 D1.2(A) HS1.2(GND) P1.1
NetC1_2: C1.2 D1.1(K) HS1.1(OUT) R1.1
NetC2_1: C2.1 R19.1
NetC4_1: C4.1 C5.1 IC1.5(GND) J5.3
NetC4_2: C4.2 IC1.8(VCC) J5.5
NetC5_2: C5.2 IC1.6(FILTER)
NetC7_1: C7.1 R44.1
NetC8_1: C8.1 C9.1 IC2.5(GND) J13.3
NetC8_2: C8.2 IC2.8(VCC) J13.5
NetC9_2: C9.2 IC2.6(FILTER)
NetC10_1: C10.1 R78.1
NetC12_1: C12.1 C14.1 IC3.5(GND) J19.3
NetC12_2: C12.2 IC3.8(VCC) J19.5
NetC14_2: C14.2 IC3.6(FILTER)
NetCR1_2: CR1.2 J1.1
NetD2_1: D2.1(A) R5.1
NetD3_1: D3.1(A) R20.1
NetD4_2: D4.2(K) R45.1
NetD5_1: D5.1(A) R48.1
NetD6_2: D6.2(K) R58.1
NetD7_1: D7.1(A) R61.1
NetD8_2: D8.2(K) R68.1
NetD9_1: D9.1(A) R73.1
NetD10_2: D10.2(A) D11.1(C) J3.1 J4.2 R7.1 R11.1 TP6.1(G9) VT1.1(E) VT4.3(E)
NetD12_2: D12.2(A) D13.1(C) IC1.3(IP-_1) IC1.4(IP-_2) J4.4 R11.2 R25.1 TP16.1(G9) VT5.1(E) VT8.3(E)
NetD14_2: D14.2(A) D15.1(C) J14.1 J15.2 R38.1 R41.1 TP28.1(G9) VT9.1(E) VT12.3(E)
NetD16_2: D16.2(A) D17.1(C) IC2.3(IP-_1) IC2.4(IP-_2) J15.4 R41.2 R51.1 TP36.1(G9) VT13.1(E) VT16.3(E)
NetD18_2: D18.2(A) D19.1(C) J20.1 J21.2 R71.1 R76.1 TP51.1(G9) VT17.1(E) VT20.3(E)
NetD20_2: D20.2(A) D21.1(C) IC3.3(IP-_1) IC3.4(IP-_2) J21.4 R76.2 R81.1 TP60.1(G9) VT21.1(E) VT24.3(E)
NetHS1_3: HS1.3(VCC) P1.3
NetIC1_1: IC1.1(IP+_1) IC1.2(IP+_2) J3.2
NetIC1_7: IC1.7(VIOUT) J5.4
NetIC2_1: IC2.1(IP+_1) IC2.2(IP+_2) J14.2
NetIC2_7: IC2.7(VIOUT) J13.4
NetIC3_1: IC3.1(IP+_1) IC3.2(IP+_2) J20.2
NetIC3_7: IC3.7(VIOUT) J19.4
NetJ2_3: J2.3 R14.1 R31.1
NetJ2_5: J2.5 R3.1
NetJ12_3: J12.3 R43.1 R63.1
NetJ12_5: J12.5 R35.1
NetJ18_3: J18.3 R77.1 R91.1
NetJ18_5: J18.5 R64.1
NetL1_2: L1.2 R8.2 R9.2
NetL2_1: L2.1 R29.1 RP3.1(CCW) RP3.2(WIPER)
NetP1_2: P1.2 R1.2
NetP4_2: P4.2 R12.1
NetP5_2: P5.2 R36.1
NetP6_2: P6.2 R65.1
NetR7_2: R7.2 R10.1 TP7.1(G9) VT2.2(E) VT3.2(E)
NetR10_2: R10.2 R25.2 TP18.1(G9) VT6.2(E) VT7.2(E)
NetR29_2: R29.2 R33.1 R34.1 RP3.3(CW)
NetR38_2: R38.2 R40.1 TP29.1(G9) VT10.2(E) VT11.2(E)
NetR40_2: R40.2 R51.2 TP40.1(G9) VT14.2(E) VT15.2(E)
NetR45_2: R45.2 R48.2 R49.2 TP33.1(G9)
NetR58_2: R58.2 R61.2 R62.2 TP43.1(G9)
NetR68_2: R68.2 R73.2 R74.2 TP53.1(G9)
NetR71_2: R71.2 R75.1 TP52.1(G9) VT18.2(E) VT19.2(E)
NetR75_2: R75.2 R81.2 TP63.1(G9) VT22.2(E) VT23.2(E)

## Notes on the sheet
- Сменная зона выходного каскада
- (in symbol Hall_Sensor) U_Hall
- (in symbol LM324AD_SOIC14, part A) +; -
- (in symbol LM324AD_SOIC14, part B) -; +
- (in symbol LM324AD_SOIC14, part C) +; -
- (in symbol LM324AD_SOIC14, part D) +; -

## Library data of the parts
C1-C5 C7-C10 C12-C14 C17-C19 = C0805C104J4RACTU
C6 C11 C15 C16 = EEE1HA101AP: Capacitor Polarised; Manufacturer_Name: Panasonic; Datasheet Link: http://industrial.panasonic.com/cdbs/www-data/pdf/RDE0000/ABA0000C1142.pdf; Manufacturer_Part_Number: EEE1HA101AP
CR1 = 1N5822RL: No Description Available; Mfr_Name: STMicroelectronics; Type: DEV; Copyright: Copyright (C) 2022 Ultra Librarian. All rights reserved.; Manufacturer_Part_Number: 1N5822RL; RefDes: RefDes
D1 = SZMM3Z5V1ST1G: Zener Voltage Regulator, 300 mW, Tight Tolerance Portfolio, 2-Pin SOD-323, Pb-Free, Tape and Reel; Manufacturer: On Semiconductor; P Max (W): 0.3; ComponentLink1Description: Manufacturer URL; ComponentLink2Description: Datasheet; PartNumber: SZMM3Z5V1ST1G; DatasheetVersion: Rev. 21; ComponentLink3URL: http://www.onsemi.com/pub_link/Collateral/477-02.PDF.1; ComponentLink3Description: Package Specification; ComponentLink1URL: http://www.onsemi.com/; ComponentLink2URL: http://www.onsemi.cn/pub_link/Collateral/MM3Z2V4ST1-D.PDF; Packing: Tape and Reel; Mounting Technology: Surface Mount; PackageReference: SOD-323-2-477-02; PackageDescription: 2-Pin SOD, Body 1.7 x 1.25 mm; PackageVersion: Rev. H, 03/2007; RoHS: Pb-Free
D2-D9 = LED2: Typical RED, GREEN, YELLOW, AMBER GaAs LED; Published: 8-Jun-2000; LatestRevisionDate: 17-Jul-2002; LatestRevisionNote: Re-released for DXP Platform.; PackageVersion: Feb-2002; PackageReference: 3.2X1.6X1.1; Publisher: Altium Limited; PackageDescription: SM LED; 2 Flat Leads
D10-D21 = Diode_Vishay_SS16-E3-61T_eec: Diode Schottky 60V 1A Surface Mount DO-214AC (SMA); Part Number: SS16-E3/61T; Manufacturer: Vishay; Voltage - Forward (Vf) (Max) @ If: 750mV @ 1A; Current - Reverse Leakage @ Vr: 200µA @ 60V; helpURL: https://upverter.com/upn/revision/46fb9ccadf7e3052/; ComponentLink2Description: Datasheet; Temperature: -65°C to +150°C; Package: DO-214AC; Supplier 2: Mouser; Price: 0.180579591464; Supplier 1: Digi-Key; ComponentLink1URL: https://upverter.com/upn/revision/46fb9ccadf7e3052/; Supplier Part Number 2: 625-SS16-E3; Supplier Part Number 1: SS16-E3/61TGICT-ND; ComponentLink1Description: Upverter; ComponentLink2URL: http://www.vishay.com/docs/88746/ss12.pdf; RoHS: TRUE; Mouser Part Number: 625-SS16-E3; Temperature Range High: +150°C; Digikey Description: Diode Schottky 60V 1A Surface Mount DO-214AC (SMA); Digikey Part Number: SS16-E3/61TGICT-ND; Current - Average Rectified (Io): 1A; Lead Free: yes; Voltage - DC Reverse (Vr) (Max): 60V; Temperature Range Low: -65°C
IC1-IC3 = ACS712ELCTR-20A-T: Integrated Circuit; Manufacturer_Name: Allegro Microsystems; Datasheet Link: https://datasheet.datasheetarchive.com/originals/distributors/SFDatasheet-0/sf-000553.pdf; Height: 1.75mm; Manufacturer_Part_Number: ACS712ELCTR-20A-T; Mouser Part Number: 250-712ELCTR20AT; Mouser Price/Stock: https://www.mouser.co.uk/ProductDetail/Allegro-MicroSystems/ACS712ELCTR-20A-T?qs=pUKx8fyJudBUdhIPMFjOBQ%3D%3D; Arrow Part Number: ACS712ELCTR-20A-T; Arrow Price/Stock: https://www.arrow.com/en/products/acs712elctr-20a-t/allegro-microsystems
J1 J3 J14 J17 J20 = 691101710002: WR-TBL Series 101 Horizontal Entry Modular, Through Hole, pitch 5mm, 2p; Manufacturer: Wurth Elektronik; Pin Number: 2; Rated Current: 16A; Working Voltage: 250V; PCB/Cable/Panel: PCB; Modularity: Yes; ComponentLink1Description: Manufacturer Link; ComponentLink1URL: https://www.we-online.com/redexpert/article/691101710002?ad; ComponentLink2Description: Datasheet; ComponentLink2URL: https://www.we-online.com/redexpert/spec/691101710002?ad; Category: Terminal Blocks; Match Code: WR-TBL; Manufacturer Part Number: 691101710002; Mount: Through Hole; Operating Temperature Max: 105°C; Operating Temperature Min: -40°C; Packaging: Box; Pitch: 5mm; Orientation: Horizontal; Application: Pressure Clamp
J7 = 691101710003: WR-TBL Series 101 Horizontal Entry Modular, Through Hole, pitch 5mm, 3p; Manufacturer: Wurth Elektronik; Pin Number: 3; Rated Current: 16A; Working Voltage: 250V; PCB/Cable/Panel: PCB; Modularity: Yes; ComponentLink1Description: Manufacturer Link; ComponentLink1URL: https://www.we-online.com/redexpert/article/691101710003?ad; ComponentLink2Description: Datasheet; ComponentLink2URL: https://www.we-online.com/redexpert/spec/691101710003?ad; Category: Terminal Blocks; Match Code: WR-TBL; Manufacturer Part Number: 691101710003; Mount: Through Hole; Operating Temperature Max: 105°C; Operating Temperature Min: -40°C; Packaging: Box; Pitch: 5mm; Orientation: Horizontal; Application: Pressure Clamp
L1 L2 = 7445720: SMD-Power Inductor WE-PD4, L = 100 µH; Inductance: 100 ÂµH; ComponentLink1Description: Manufacturer Link; ComponentLink2Description: Datasheet; DatasheetVersion: ver 1, Oct-2004; ComponentLink1URL: http://www.we-online.com; PackageVersion: 2004; PackageDescription: SMD Inductor, 2-Leads, Body 22.0 x 15.0 mm; ComponentLink2URL: http://www.we-online.de/katalog/media/pdf/7445720.pdf; PackageReference: WE-PD4-XL; PartNumber: 7445720
P1-P6 = 61900311121: WR-WTB THT Male Vertical Locking Header, pitch 2.54mm, 3p; Pin Number: 3; Contact Resistance: 20mOhm; Rated Current: 3A; Withstanding Voltage: 1000VAC; Working Voltage: 250VAC; ComponentLink1Description: Manufacturer; ComponentLink1URL: http://www.we-online.de; ComponentLink2Description: Datasheet; ComponentLink2URL: https://www.we-online.com/catalog/datasheet/61900311121.pdf; Pitch: 2.54mm; Published Date: January 2020; Publisher: Wurth Elektronik; Mounting Technology: THT; Packaging: Bag; Operating Temperature: -40 to +105degC; Part Number: 61900311121; Gender: Male; Type: Vertical
R1-R91 = CRCW08050000Z0EA
  R1 R3-R27 R29-R41 R43-R51 R53 R54 R56-R66 R68-R91: 10k: *
  R2 R28 R42 R52 R55 R67: 100k: *
RP1 RP3 RP4 RP6 RP8 = 3296W-1-202LF
TP1-TP70 = TP_PCB?: Test_Point
VT3 VT7 VT11 VT15 VT19 VT23 = MMBT2907ALT1G: No Description Available; Mfr_Name: onsemi; Type: DEV; Copyright: Copyright (C) 2022 Ultra Librarian. All rights reserved.; Manufacturer_Part_Number: MMBT2907ALT1G; RefDes: RefDes
Z1 Z2 = BZX85C5V1(YJ)